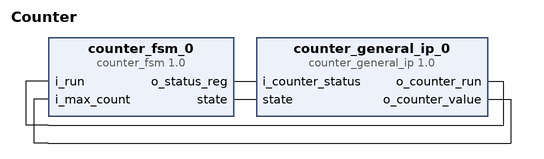
[diagram p0: block diagram of the top level]
# Vivado block design Counter, xc7z020clg400-1, Vivado 2025.1
create_bd_design Counter

create_bd_cell -type ip -vlnv xilinx.com:user:counter_general_ip:1.0 counter_general_ip_0
create_bd_cell -type ip -vlnv xilinx.com:user:counter_fsm:1.0 counter_fsm_0

# ---- connections ----

connect_bd_net [get_bd_pins counter_fsm_0/o_status_reg] [get_bd_pins counter_general_ip_0/i_counter_status]
connect_bd_net [get_bd_pins counter_fsm_0/state] [get_bd_pins counter_general_ip_0/state]
connect_bd_net [get_bd_pins counter_general_ip_0/o_counter_run] [get_bd_pins counter_fsm_0/i_run]
connect_bd_net [get_bd_pins counter_general_ip_0/o_counter_value] [get_bd_pins counter_fsm_0/i_max_count]

validate_bd_design
save_bd_design
